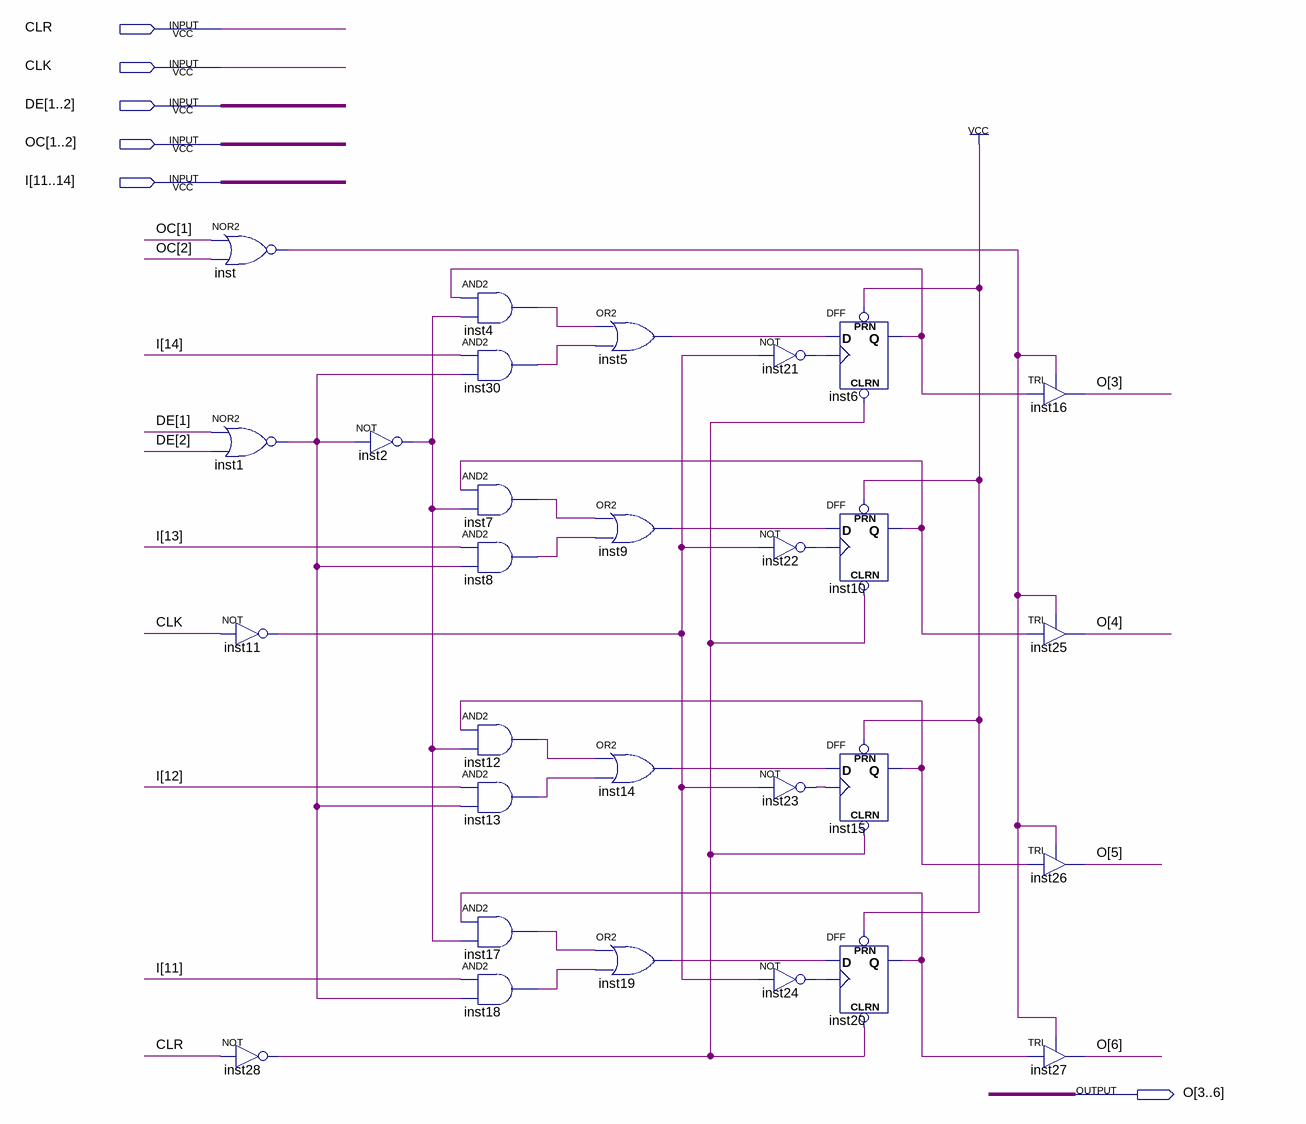
[diagram p0: schematic sheet]
// Quartus schematic c8.bdf as structural Verilog: 29 symbols, 6 pins
module c8 (
  input  CLR,
  input  CLK,
  input  [1:2] DE,
  input  [1:2] OC,
  input  [11:14] I,
  output [3:6] O
);

  wire inst1_out, inst2_out, inst4_out, inst5_out, inst6_q, inst7_out, inst8_out, inst9_out, inst10_q,
       inst11_out, inst12_out, inst13_out, inst14_out, inst15_q, inst17_out, inst18_out, inst19_out,
       inst20_q, inst21_out, inst22_out, inst23_out, inst24_out, inst28_out, inst30_out, inst_out;

  nor inst (inst_out, OC[1], OC[2]);
  nor inst1 (inst1_out, DE[1], DE[2]);
  not inst11 (inst11_out, CLK);
  not inst28 (inst28_out, CLR);
  not inst2 (inst2_out, inst1_out);
  and inst4 (inst4_out, inst6_q, inst2_out);
  and inst30 (inst30_out, I[14], inst1_out);
  and inst7 (inst7_out, inst10_q, inst2_out);
  and inst8 (inst8_out, I[13], inst1_out);
  and inst12 (inst12_out, inst15_q, inst2_out);
  and inst13 (inst13_out, I[12], inst1_out);
  and inst17 (inst17_out, inst20_q, inst2_out);
  and inst18 (inst18_out, I[11], inst1_out);
  or inst5 (inst5_out, inst4_out, inst30_out);
  or inst9 (inst9_out, inst7_out, inst8_out);
  or inst14 (inst14_out, inst12_out, inst13_out);
  or inst19 (inst19_out, inst17_out, inst18_out);
  not inst21 (inst21_out, inst11_out);
  not inst22 (inst22_out, inst11_out);
  not inst23 (inst23_out, inst11_out);
  not inst24 (inst24_out, inst11_out);
  DFF inst6 (.CLRN(inst28_out), .CLK(inst21_out), .D(inst5_out), .PRN(1'b1), .Q(inst6_q));
  DFF inst10 (.CLRN(inst28_out), .CLK(inst22_out), .D(inst9_out), .PRN(1'b1), .Q(inst10_q));
  DFF inst15 (.CLRN(inst28_out), .CLK(inst23_out), .D(inst14_out), .PRN(1'b1), .Q(inst15_q));
  DFF inst20 (.CLRN(inst28_out), .CLK(inst24_out), .D(inst19_out), .PRN(1'b1), .Q(inst20_q));
  TRI inst16 (.IN(inst6_q), .OE(inst_out), .OUT(O[3]));
  TRI inst25 (.IN(inst10_q), .OE(inst_out), .OUT(O[4]));
  TRI inst26 (.IN(inst15_q), .OE(inst_out), .OUT(O[5]));
  TRI inst27 (.IN(inst20_q), .OE(inst_out), .OUT(O[6]));
endmodule
